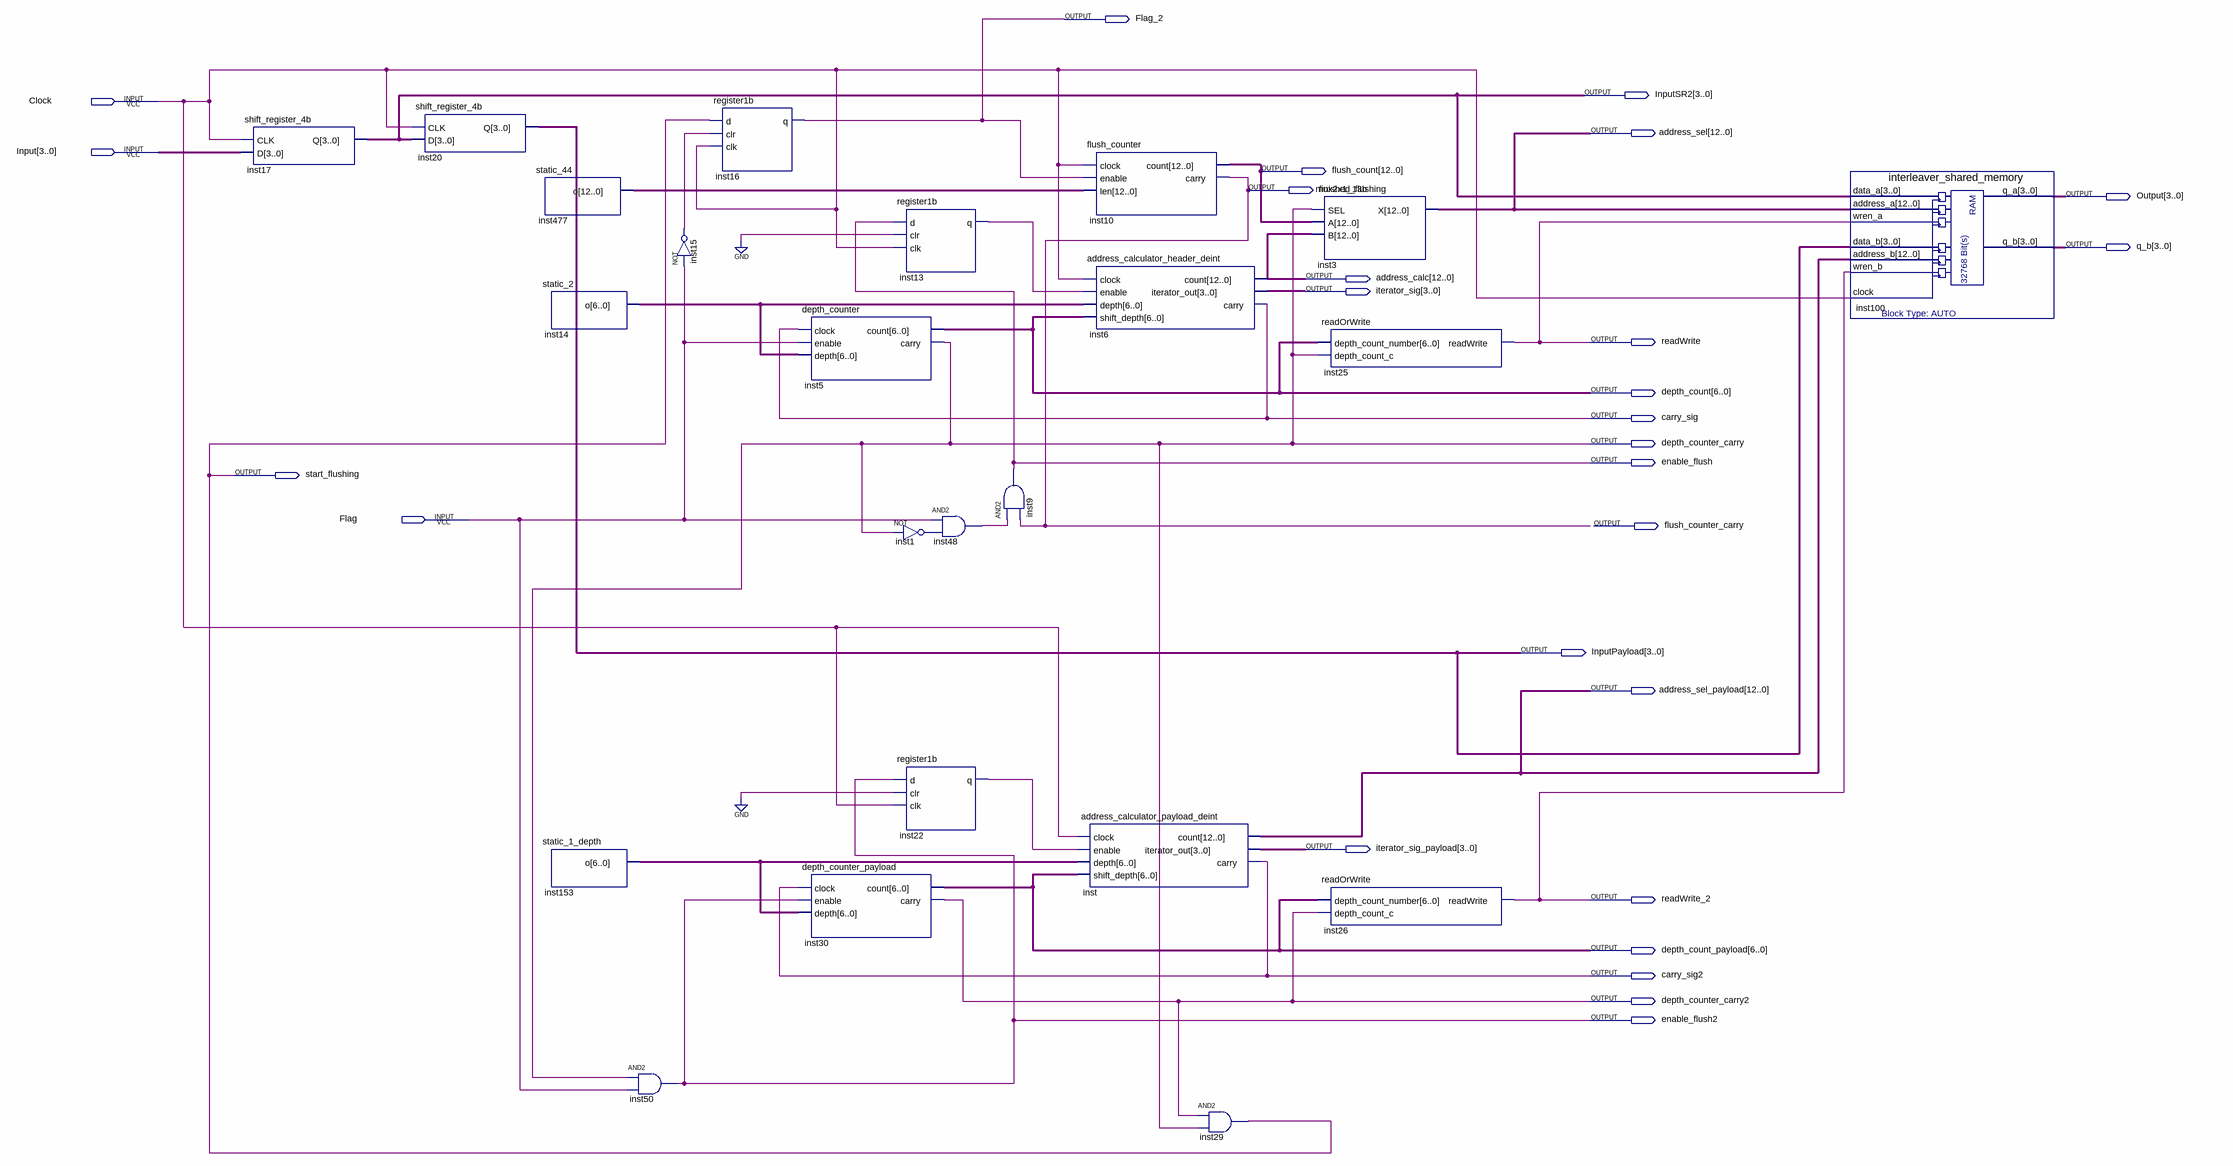
[diagram p0: schematic sheet]
// Quartus schematic deinterleaver_vai.bdf as structural Verilog: 23 symbols, 27 pins
module deinterleaver_vai (
  input  Clock,
  input  [3:0] Input,
  input  Flag,
  output Flag_2,
  output [3:0] InputSR2,
  output [12:0] address_sel,
  output [12:0] flush_count,
  output finished_flushing,
  output [3:0] Output,
  output [3:0] q_b,
  output [12:0] address_calc,
  output [3:0] iterator_sig,
  output readWrite,
  output [6:0] depth_count,
  output carry_sig,
  output depth_counter_carry,
  output enable_flush,
  output start_flushing,
  output flush_counter_carry,
  output [3:0] InputPayload,
  output [12:0] address_sel_payload,
  output [3:0] iterator_sig_payload,
  output readWrite_2,
  output [6:0] depth_count_payload,
  output carry_sig2,
  output depth_counter_carry2,
  output enable_flush2
);

  wire inst1_out, inst13_q, inst15_out, inst22_q, inst48_out;
  wire [6:0] inst14_o, inst153_o;
  wire [12:0] inst477_o;

  shift_register_4b inst17 (.CLK(Clock), .D(Input), .Q(InputSR2));
  shift_register_4b inst20 (.CLK(Clock), .D(InputSR2), .Q(InputPayload));
  static_44 inst477 (.o(inst477_o));
  static_2 inst14 (.o(inst14_o));
  static_1_depth inst153 (.o(inst153_o));
  and inst50 (enable_flush2, depth_counter_carry, Flag);
  not inst15 (inst15_out, Flag);
  register1b inst16 (.d(start_flushing), .clr(inst15_out), .clk(Clock), .q(Flag_2));
  depth_counter inst5 (
    .clock(carry_sig), .enable(Flag), .depth(inst14_o), .count(depth_count), .carry(depth_counter_carry));
  depth_counter_payload inst30 (
    .clock(carry_sig2), .enable(enable_flush2), .depth(inst153_o), .count(depth_count_payload),
    .carry(depth_counter_carry2));
  register1b inst13 (.d(enable_flush), .clr(1'b0), .clk(Clock), .q(inst13_q));
  not inst1 (inst1_out, depth_counter_carry);
  register1b inst22 (.d(enable_flush2), .clr(1'b0), .clk(Clock), .q(inst22_q));
  and inst48 (inst48_out, Flag, inst1_out);
  and inst9 (enable_flush, inst48_out, finished_flushing);
  flush_counter inst10 (
    .clock(Clock), .enable(Flag_2), .len(inst477_o), .count(flush_count), .carry(finished_flushing));
  address_calculator_header_deint inst6 (
    .clock(Clock), .enable(inst13_q), .depth(inst14_o), .shift_depth(depth_count), .count(address_calc),
    .iterator_out(iterator_sig), .carry(carry_sig));
  address_calculator_payload_deint inst (
    .clock(Clock), .enable(inst22_q), .depth(inst153_o), .shift_depth(depth_count_payload),
    .count(address_sel_payload), .iterator_out(iterator_sig_payload), .carry(carry_sig2));
  and inst29 (start_flushing, depth_counter_carry2, depth_counter_carry);
  mux2x1_13b inst3 (.SEL(depth_counter_carry), .A(flush_count), .B(address_calc), .X(address_sel));
  readOrWrite inst25 (.depth_count_number(depth_count), .depth_count_c(depth_counter_carry), .readWrite(readWrite));
  readOrWrite inst26 (
    .depth_count_number(depth_count_payload), .depth_count_c(depth_counter_carry2), .readWrite(readWrite_2));
  interleaver_shared_memory inst100 (
    .data_a(InputSR2), .address_a(address_sel), .wren_a(readWrite), .data_b(InputPayload),
    .address_b(address_sel_payload), .wren_b(readWrite_2), .clock(Clock), .q_a(Output), .q_b(q_b));

  assign flush_counter_carry = finished_flushing;
endmodule
